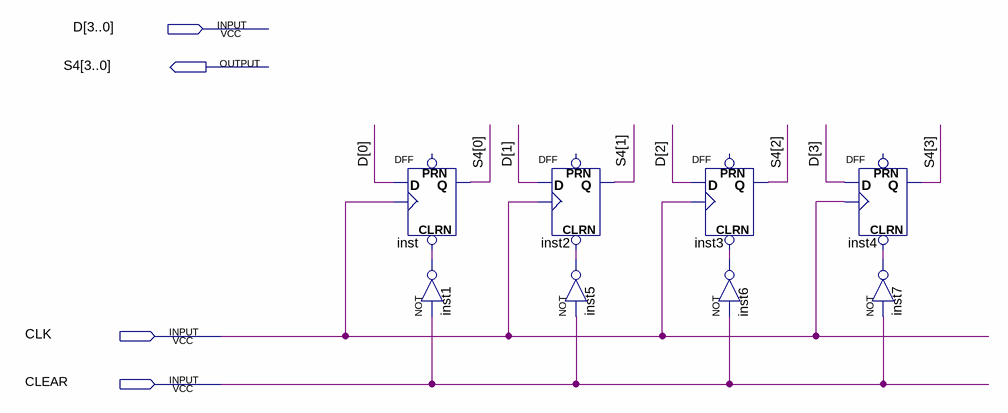
[diagram p0: schematic sheet]
// Quartus schematic Reg4.bdf as structural Verilog: 8 symbols, 4 pins
module Reg4 (
  input  [3:0] D,
  input  CLK,
  input  CLEAR,
  output [3:0] S4
);

  wire inst1_out, inst5_out, inst6_out, inst7_out;

  DFF inst (.CLRN(inst1_out), .CLK(CLK), .D(D[0]), .Q(S4[0]));  // open: PRN
  not inst1 (inst1_out, CLEAR);
  DFF inst2 (.CLRN(inst5_out), .CLK(CLK), .D(D[1]), .Q(S4[1]));  // open: PRN
  not inst5 (inst5_out, CLEAR);
  DFF inst3 (.CLRN(inst6_out), .CLK(CLK), .D(D[2]), .Q(S4[2]));  // open: PRN
  not inst6 (inst6_out, CLEAR);
  DFF inst4 (.CLRN(inst7_out), .CLK(CLK), .D(D[3]), .Q(S4[3]));  // open: PRN
  not inst7 (inst7_out, CLEAR);
endmodule
